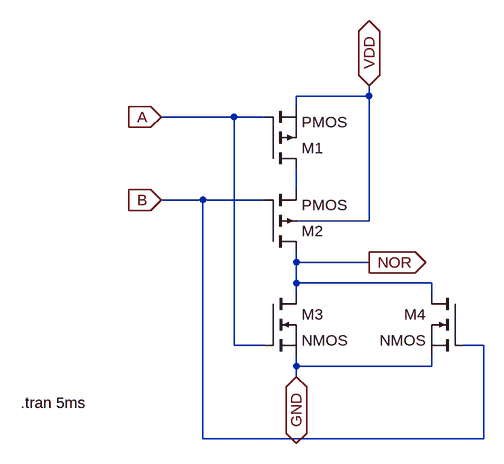
[diagram p0: schematic nor.asc]
nor.asc, the LTspice schematic file:
Version 4
SHEET 1 880 680
WIRE 336 32 336 16
WIRE 336 32 224 32
WIRE 224 48 224 32
WIRE 128 64 16 64
WIRE 176 64 128 64
WIRE 224 176 224 144
WIRE 80 192 16 192
WIRE 176 192 80 192
WIRE 336 224 336 32
WIRE 336 224 224 224
WIRE 224 288 224 272
WIRE 336 288 224 288
WIRE 224 320 224 288
WIRE 432 320 224 320
WIRE 224 336 224 320
WIRE 432 336 432 320
WIRE 128 416 128 64
WIRE 176 416 128 416
WIRE 512 416 480 416
WIRE 224 448 224 432
WIRE 432 448 432 432
WIRE 432 448 224 448
WIRE 224 464 224 448
WIRE 80 560 80 192
WIRE 512 560 512 416
WIRE 512 560 80 560
FLAG 16 64 A
IOPIN 16 64 In
FLAG 16 192 B
IOPIN 16 192 In
FLAG 336 16 VDD
IOPIN 336 16 BiDir
FLAG 224 464 GND
IOPIN 224 464 BiDir
FLAG 336 288 NOR
IOPIN 336 288 Out
SYMBOL pmos 176 144 M180
SYMATTR InstName M1
SYMBOL nmos 176 336 R0
SYMATTR InstName M3
SYMBOL nmos 480 336 M0
SYMATTR InstName M4
SYMBOL pmos4 176 272 M180
SYMATTR InstName M2
TEXT -200 504 Left 2 !.tran 5ms

The netlist it stands for:
* nor.asc
M1 N001 A VDD VDD PMOS
M3 NOR A GND GND NMOS
M4 NOR B GND GND NMOS
M2 NOR B N001 VDD PMOS
.model NMOS NMOS
.model PMOS PMOS
.lib standard.mos
.tran 5ms
.backanno
.end